# EAGLE design ucar (EAGLE 7.7.0)
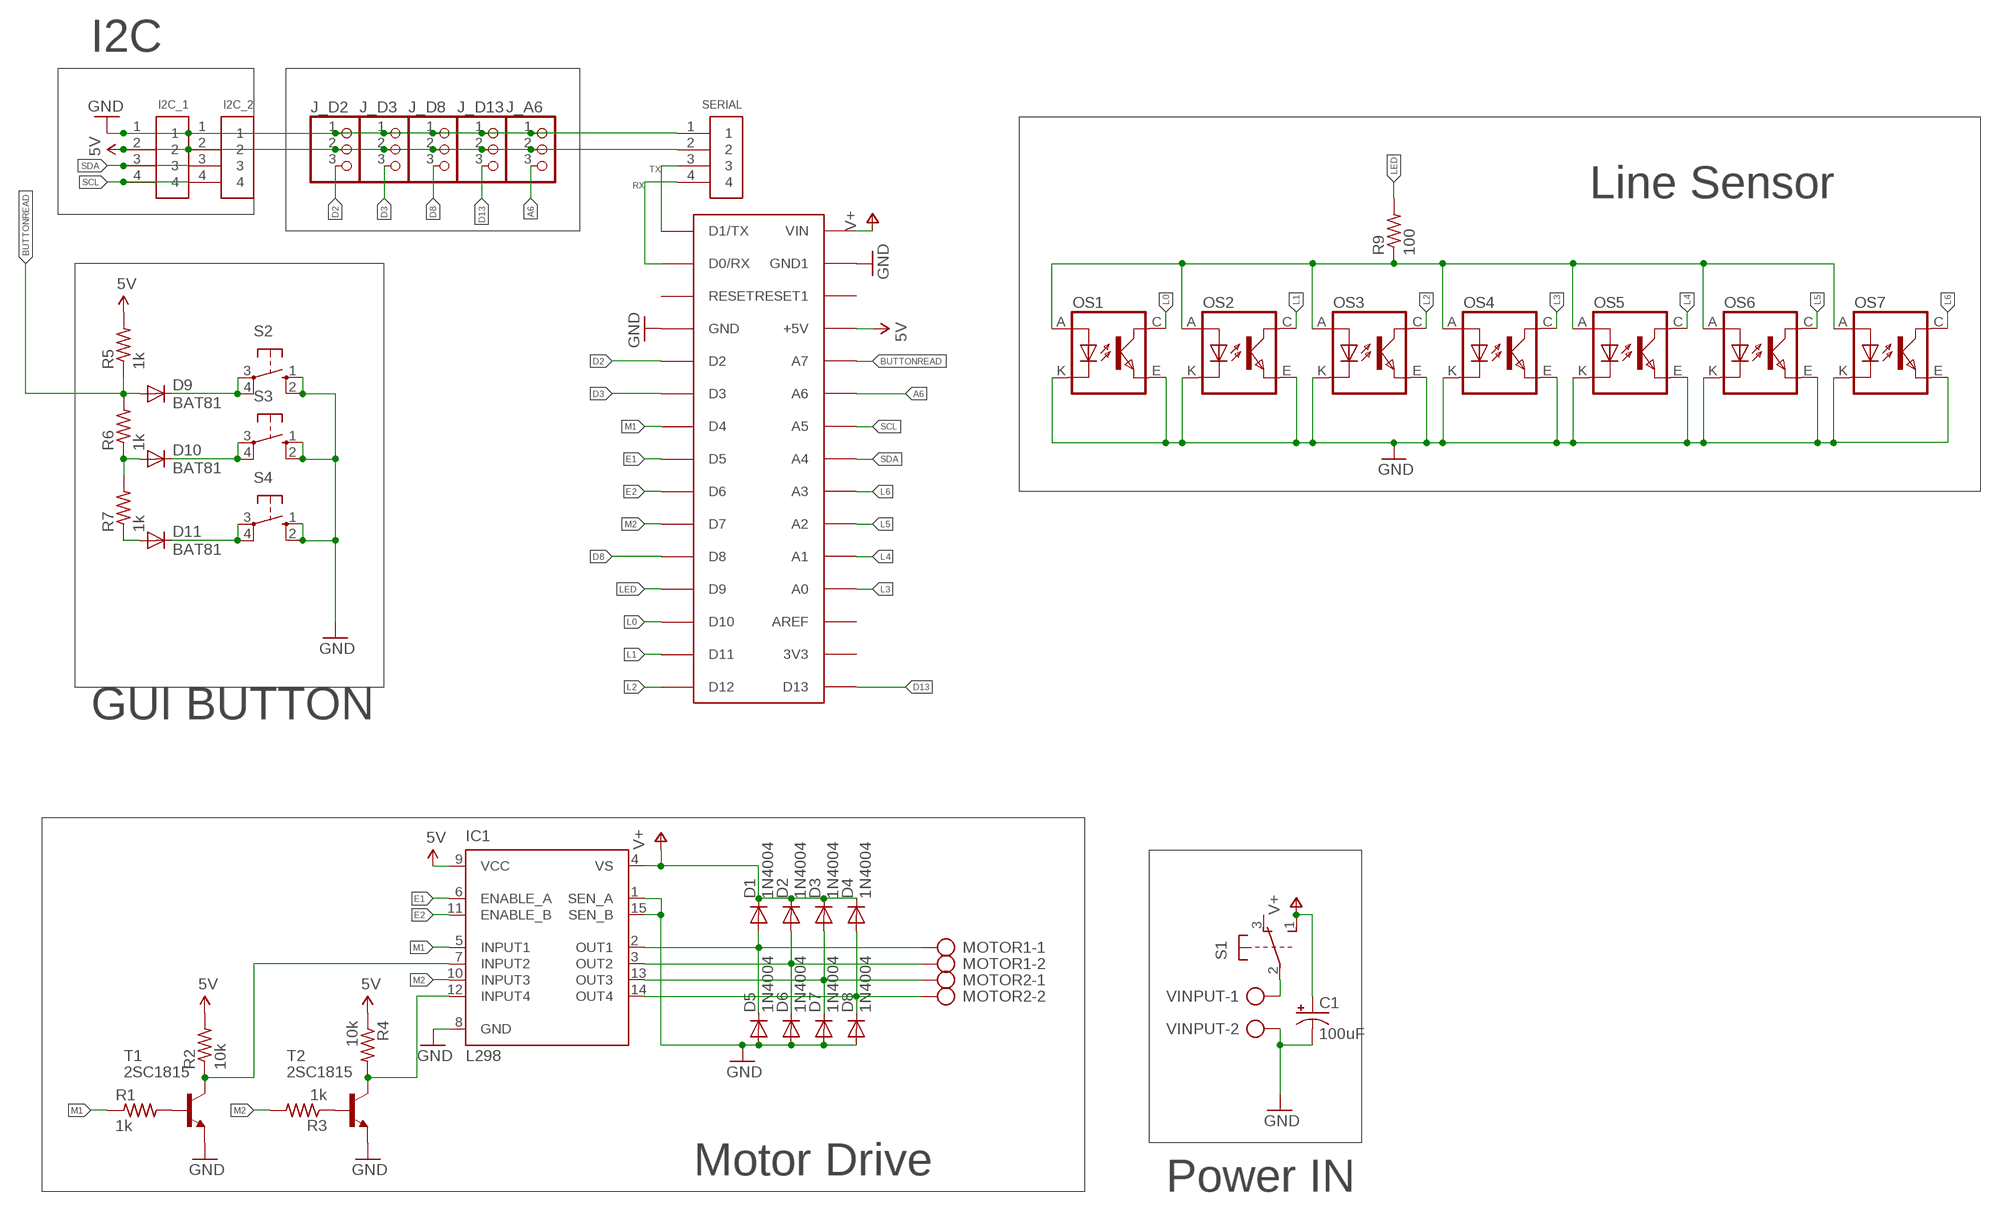
[diagram p0: schematic, sheet 1]

## Parts
C1  100uF  CPOL-USE2.5-6  [E2,5-6]
D1  1N4004  [DO41-10]
D2  1N4004  [DO41-10]
D3  1N4004  [DO41-10]
D4  1N4004  [DO41-10]
D5  1N4004  [DO41-10]
D6  1N4004  [DO41-10]
D7  1N4004  [DO41-10]
D8  1N4004  [DO41-10]
D9  BAT81  [DO34-7]
D10  BAT81  [DO34-7]
D11  BAT81  [DO34-7]
I2C_1  1X4-BIG  [1X04-BIG]
I2C_2  1X4-BIG  [1X04-BIG]
IC1  L298  [MULTIWATT-15]
J_A6  PINHD-1X3  [1X03]
J_D2  PINHD-1X3  [1X03]
J_D3  PINHD-1X3  [1X03]
J_D8  PINHD-1X3  [1X03]
J_D13  PINHD-1X3  [1X03]
MOTOR1  AK500/2  [AK500/2]
MOTOR2  AK500/2  [AK500/2]
OS1  TCRT5000  [TCRT5000]
OS2  TCRT5000  [TCRT5000]
OS3  TCRT5000  [TCRT5000]
OS4  TCRT5000  [TCRT5000]
OS5  TCRT5000  [TCRT5000]
OS6  TCRT5000  [TCRT5000]
OS7  TCRT5000  [TCRT5000]
R1  1k  R-US_0207/7  [0207/7]
R2  10k  R-US_0207/7  [0207/7]
R3  1k  R-US_0207/7  [0207/7]
R4  10k  R-US_0207/7  [0207/7]
R5  1k  R-US_0207/7  [0207/7]
R6  1k  R-US_0207/7  [0207/7]
R7  1k  R-US_0207/7  [0207/7]
R9  100  R-US_0204/5  [0204/5]
S1  9077-2  [9077-2]
S2  10-XX  [B3F-10XX]
S3  10-XX  [B3F-10XX]
S4  10-XX  [B3F-10XX]
SERIAL  1X4-BIG  [1X04-BIG]
T1  2SC1815  [TO92-ECB]
T2  2SC1815  [TO92-ECB]
U$1  ARDUINONANO  [PDIP-32]
VINPUT  AK500/2  [AK500/2]

## Nets
5V: I2C_1.2 I2C_2.2 IC1.9(VCC) J_A6.2 J_D2.2 J_D3.2 J_D8.2 J_D13.2 R2.2 R4.1 R5.2 SERIAL.2 U$1.+5V
A6: J_A6.3 U$1.A6
BUTTONREAD: D9.A R5.1 R6.2 U$1.A7
D2: J_D2.3 U$1.D2
D3: J_D3.3 U$1.D3
D8: J_D8.3 U$1.D8
D13: J_D13.3 U$1.D13
E1: IC1.6(ENABLE_A) U$1.D5
E2: IC1.11(ENABLE_B) U$1.D6
GND: C1.- D5.A D6.A D7.A D8.A I2C_1.1 I2C_2.1 IC1.1(SEN_A) IC1.8(GND) IC1.15(SEN_B) J_A6.1 J_D2.1 J_D3.1 J_D8.1 J_D13.1 OS1.E(EMITTER) OS1.K(CATHODE) OS2.E(EMITTER) OS2.K(CATHODE) OS3.E(EMITTER) OS3.K(CATHODE) OS4.E(EMITTER) OS4.K(CATHODE) OS5.E(EMITTER) OS5.K(CATHODE) OS6.E(EMITTER) OS6.K(CATHODE) OS7.E(EMITTER) OS7.K(CATHODE) S2.1(S) S2.2(S1) S3.1(S) S3.2(S1) S4.1(S) S4.2(S1) SERIAL.1 T1.E T2.E U$1.GND U$1.GND1 VINPUT.2
L0: OS1.C(COLLECTOR) U$1.D10
L1: OS2.C(COLLECTOR) U$1.D11
L2: OS3.C(COLLECTOR) U$1.D12
L3: OS4.C(COLLECTOR) U$1.A0
L4: OS5.C(COLLECTOR) U$1.A1
L5: OS6.C(COLLECTOR) U$1.A2
L6: OS7.C(COLLECTOR) U$1.A3
LED: R9.2 U$1.D9
M1: IC1.5(INPUT1) R1.1 U$1.D4
M2: IC1.10(INPUT3) R3.2 U$1.D7
N$1: OS1.A(ANODE) OS2.A(ANODE) OS3.A(ANODE) OS4.A(ANODE) OS5.A(ANODE) OS6.A(ANODE) OS7.A(ANODE) R9.1
N$2: R1.2 T1.B
N$3: D1.A D5.C IC1.2(OUT1) MOTOR1.1
N$4: R3.1 T2.B
N$5: D2.A D6.C IC1.3(OUT2) MOTOR1.2
N$6: D3.A D7.C IC1.13(OUT3) MOTOR2.1
N$7: IC1.7(INPUT2) R2.1 T1.C
N$8: D4.A D8.C IC1.14(OUT4) MOTOR2.2
N$9: IC1.12(INPUT4) R4.2 T2.C
N$10: S1.2(1:P) VINPUT.1
N$12: D10.A R6.1 R7.2
N$13: D11.A R7.1
N$14: D9.C S2.3(P) S2.4(P1)
N$15: D10.C S3.3(P) S3.4(P1)
N$16: D11.C S4.3(P) S4.4(P1)
RX: SERIAL.4 U$1.D0/RX
SCL: I2C_1.4 I2C_2.4 U$1.A5
SDA: I2C_1.3 I2C_2.3 U$1.A4
TX: SERIAL.3 U$1.D1/TX
V+: C1.+ D1.C D2.C D3.C D4.C IC1.4(VS) S1.1(1:S) U$1.VIN
Unconnected: S1.3(1:O) S1.4(2:S) S1.5(2:P) S1.6(2:O) U$1.3V3 U$1.AREF U$1.RESET U$1.RESET1

## Notes on the sheet
- I2C
- Line Sensor
- GUI BUTTON
- Motor Drive
- Power IN

## Library data of the parts
C1 = rcl:CPOL-US: POLARIZED CAPACITOR, American symbol
D1-D8 = diode:1N4004: DIODE general purpose rectifier, 1 A
D9-D11 = diode:BAT81: DIODE barrier diode
I2C_1 I2C_2 SERIAL = adafruit:1X4: 4-pin connector
IC1 = st-microelectronics:L298: DUAL FULL-BRIDGE DRIVER; MPN: L298N; OC_FARNELL: 1589425; OC_NEWARK: 32M1527
J_A6 J_D2 J_D3 J_D8 J_D13 = adafruit:PINHD-1X3: PIN HEADER
MOTOR1 MOTOR2 VINPUT = con-ptr500:AK500/2: CONNECTOR; OC_FARNELL: unknown; OC_NEWARK: unknown
OS1-OS7 = tcrt5000:TCRT5000
R1-R4 R9 = rcl:R-US_: RESISTOR, American symbol
R5-R7 = resistor:R-US_: RESISTOR, American symbol
S1 = switch-misc:9077-2: MARQUARDT SWITCH 9077.0200 Distributor: Buerklin <https://www.buerklin.com/default.asp?event=ShowArtikel%2812G2822%29&l=d&jump=ArtNr_12G2822>
S2-S4 = switch-omron:10-XX: OMRON SWITCH; MPN: B3F-1000; OC_FARNELL: 176432; OC_NEWARK: 36M3542
T1 T2 = transistor:2SC1815: NPN EPITAXIAL TRANSISTOR Source: TOSHIBA .. 2SC1815 1.pdf
U$1 = jet-lib:ARDUINONANO

## Board
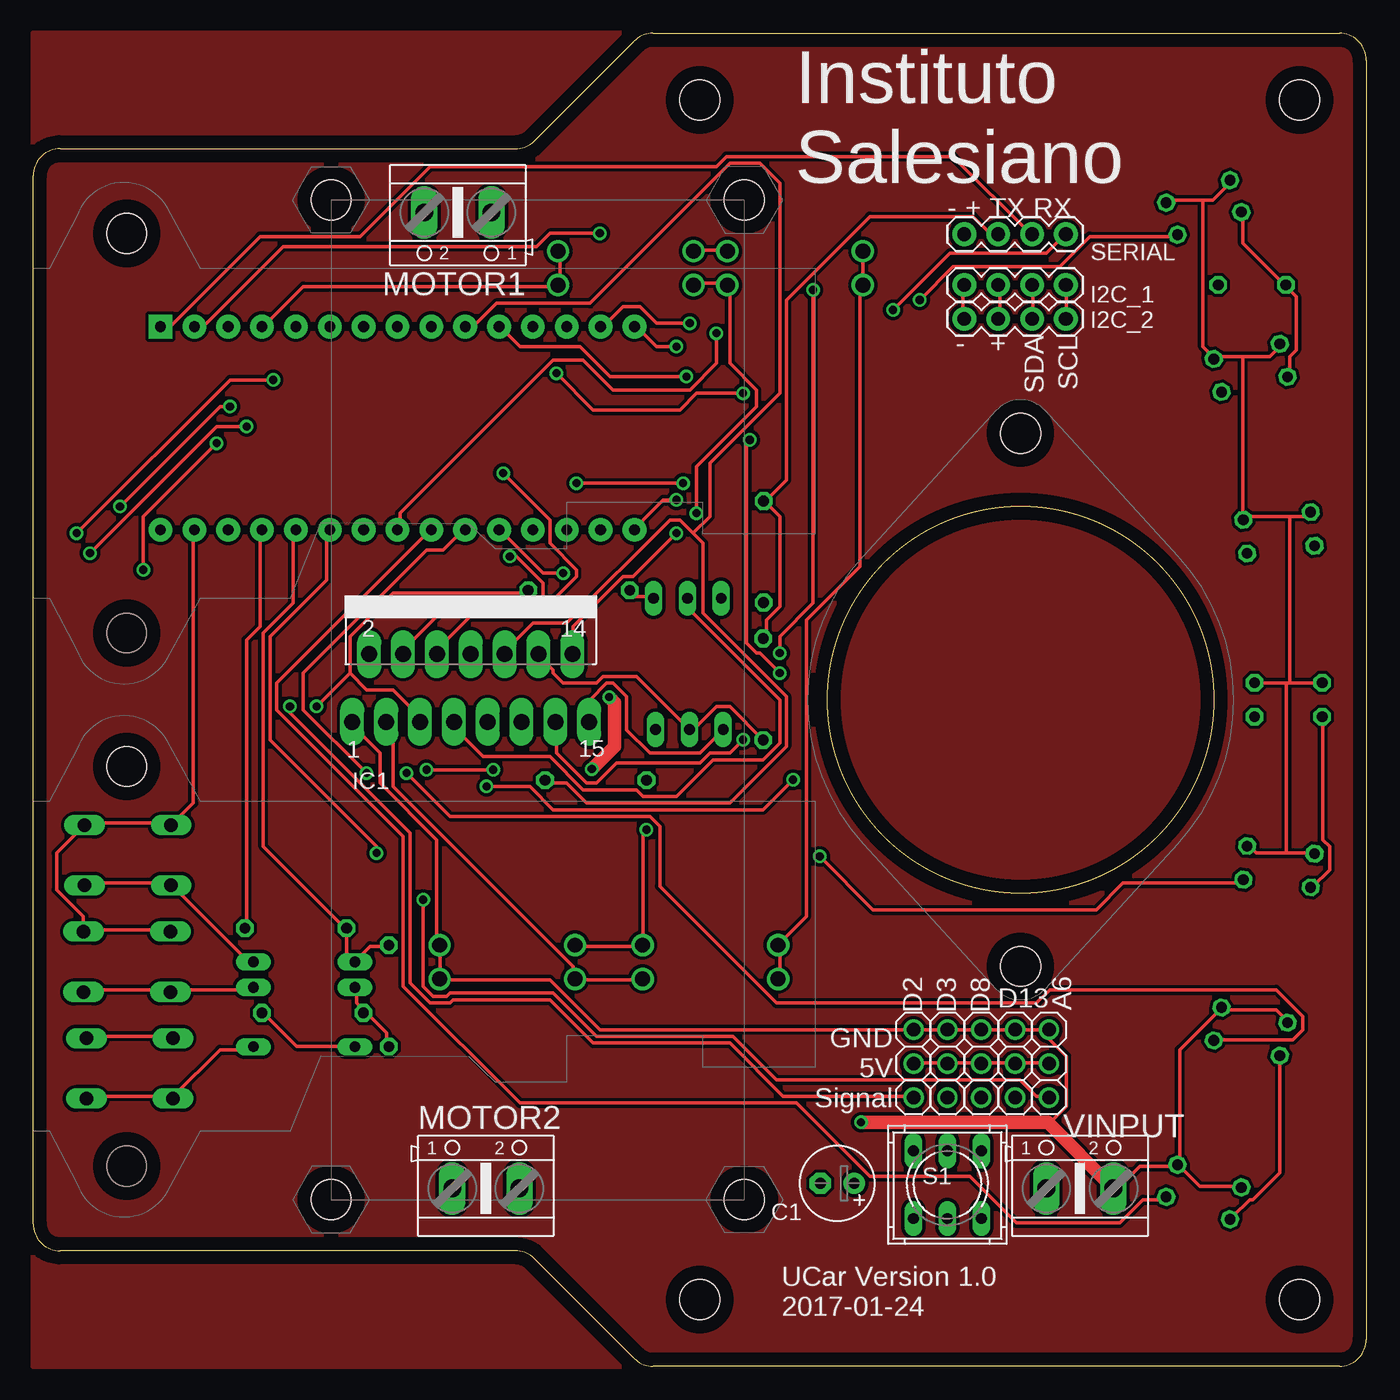
[diagram p1: board, top side]
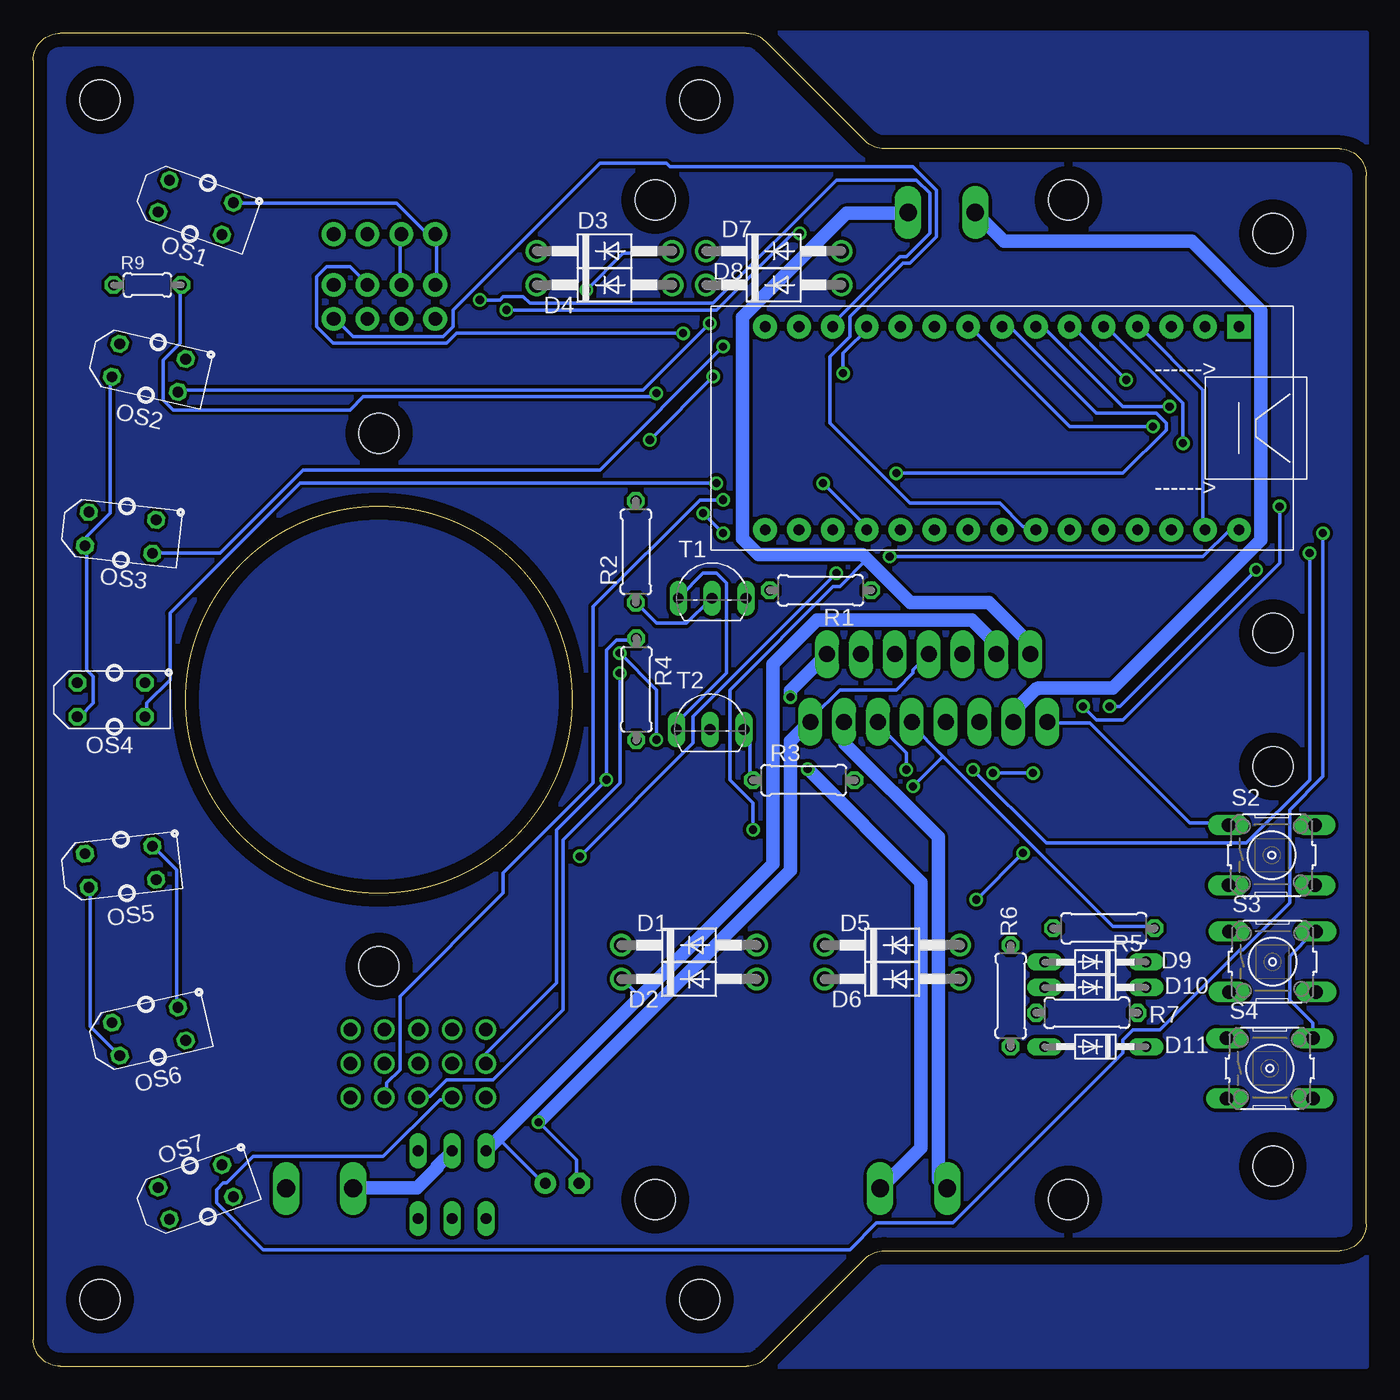
[diagram p2: board, bottom side, seen from below]

Size 100 x 100 mm. Coordinates in mm from the lower left corner, seen from the top.
Outline: 100,98 100,2 arc-90 98,0 46.49,0 arc-45 45.08,0.59 37.59,8.08 arc45 36.17,8.66 2,8.66 arc-90 0,10.66 0,89.34 arc-90 2,91.34 36.17,91.34 arc45 37.59,91.92 45.08,99.41 arc-45 46.49,100 98,100 arc-90 100,98
Outline: circle at 74.07,50 radius 14.5
Copper layers (1*16): Top 0.035mm / dielectric 1.5mm / Bottom 0.035mm
Design rules "default *": minimum track width 0.25mm, minimum drill 24mil, track to track 0.25mm, track to pad 0.25mm, pad to pad 0.25mm, via to via 0.25mm, smd to smd 0.25mm, copper to edge 40mil, drill to drill 8mil, minimum pad ring 10mil, minimum via ring 8mil, stop-mask expansion 4mil, vias tented up to drill 0mil, thermal gap 10mil
Holes 3 mm at 7,84.99 7,55.01 7,44.99 7,15.01 22.34,12.5 53.34,12.5 50,5 95,5 74.07,30 74.07,70 95,95 50,95 53.34,87.5 22.34,87.5

### Footprints (pad centres in the part's own frame; a part is rotated, then mirrored left to right if it is on the bottom)
E2,5-6 = drill 0.813 pad 1.6: + -1.27,0 | drill 0.813 pad 1.6 octagon: - 1.27,0
DO41-10 = drill 1.118: A 5.08,0; C -5.08,0
DO34-7 = drill 0.813 long: A 3.81,0; C -3.81,0
1X04-BIG = drill 1.016 pad 1.778: 1 0,0; 2 2.54,0; 3 5.08,0; 4 7.62,0
MULTIWATT-15 = drill 1.2 long: 1 -8.89,-7.62; 2 -7.62,-2.54; 3 -6.35,-7.62; 4 -5.08,-2.54; 5 -3.81,-7.62; 6 -2.54,-2.54; 7 -1.27,-7.62; 8 0,-2.54; 9 1.27,-7.62; 10 2.54,-2.54; 11 3.81,-7.62; 12 5.08,-2.54; 13 6.35,-7.62; 14 7.62,-2.54; 15 8.89,-7.62
1X03 = drill 1.016: 1 -2.54,0; 2 0,0; 3 2.54,0
AK500/2 = drill 1.321 long: 1 -2.515,0; 2 2.515,0
TCRT5000 = drill 0.8 octagon: A -2.54,-1.27; C 2.54,-1.27; E 2.54,1.27; K -2.54,1.27
0207/7 = drill 0.813 octagon: 1 -3.81,0; 2 3.81,0
0204/5 = drill 0.813 octagon: 1 -2.54,0; 2 2.54,0
9077-2 = drill 0.813 long: 1 -2.54,2.54; 2 0,2.54; 3 2.54,2.54; 4 -2.54,-2.54; 5 0,-2.54; 6 2.54,-2.54
B3F-10XX = drill 1.016 long: 1 -3.251,2.261; 2 3.251,2.261; 3 -3.251,-2.261; 4 3.251,-2.261
TO92-ECB = drill 0.813 long: B 2.54,0; C 0,0; E -2.54,0
PDIP-32 = drill 0.8 pad 1.778: 3V3 15.24,-35.56; +5V 15.24,-10.16; A0 15.24,-30.48; A1 15.24,-27.94; A2 15.24,-25.4; A3 15.24,-22.86; A4 15.24,-20.32; A5 15.24,-17.78; A6 15.24,-15.24; A7 15.24,-12.7; AREF 15.24,-33.02; D0/RX 0,-5.08; D2 0,-12.7; D3 0,-15.24; D4 0,-17.78; D5 0,-20.32; D6 0,-22.86; D7 0,-25.4; D8 0,-27.94; D9 0,-30.48; D10 0,-33.02; D11 0,-35.56; D12 0,-38.1; D13 15.24,-38.1; GND 0,-10.16; GND1 15.24,-5.08; RESET 0,-7.62; RESET1 15.24,-7.62; VIN 15.24,-2.54 | drill 0.8 pad 1.778 square: D1/TX 0,-2.54

### Placement (x,y rotation side)
C1  60.32,13.72 180 top
D1  50.8,31.59 0 bottom
D2  50.8,29.05 0 bottom
D3  57.15,83.66 0 bottom
D4  57.15,81.12 0 bottom
D5  35.56,31.59 0 bottom
D6  35.56,29.05 0 bottom
D7  44.45,83.66 0 bottom
D8  44.45,81.12 0 bottom
D9  20.32,30.32 180 bottom
D10  20.32,28.41 180 bottom
D11  20.32,23.97 180 bottom
I2C_1  69.85,81.12 0 top
I2C_2  69.85,78.58 0 top
IC1  32.82,55.97 0 top
J_A6  76.2,22.7 270 top
J_D2  66.04,22.7 270 top
J_D3  68.58,22.7 270 top
J_D8  71.12,22.7 270 top
J_D13  73.66,22.7 270 top
MOTOR1  31.85,86.56 180 top
MOTOR2  33.95,13.34 0 top
OS1  87.81,86.94 340.5 bottom
OS2  91.33,74.9 347 bottom
OS3  93.45,62.53 353.5 bottom
OS4  94.16,50 0 bottom
OS5  93.45,37.47 6.5 bottom
OS6  91.33,25.11 13 bottom
OS7  87.81,13.06 19.5 bottom
R1  40.94,58.21 180 bottom
R2  54.79,61.1 90 bottom
R3  42.2,43.97 0 bottom
R4  54.76,50.78 270 bottom
R5  19.68,32.86 0 bottom
R6  26.67,27.78 90 bottom
R7  20.95,26.51 180 bottom
R9  91.44,81.12 0 bottom
S1  68.58,13.62 0 top
S2  7.09,38.34 0 bottom
S3  7.03,30.34 0 bottom
S4  7.23,22.34 0 bottom
SERIAL  69.85,84.93 0 top
T1  49.07,57.61 0 bottom
T2  49.22,47.77 0 bottom
U$1  7,78 270 bottom
VINPUT  78.52,13.34 0 top

### Tracks (layer width: path | path; a pad name or v marks a point on that pad's centre or on a via)
5V  (via drill 0.61)
  Top 0.25: U$1.+5V 17,62.75 17,55.5 16,54.5 16,33 R5.2 | J_D2.2 66.25,22.75 68.5,22.75 J_D3.2 68.75,22.75 71,22.75 J_D8.2 71.25,22.75 73.5,22.75 J_D13.2 73.75,22.75 76,22.75 J_A6.2 | I2C_2.2 72.5,78.75 72.5,81 I2C_1.2 | R4.1 55,54.75 55,56 56,57 56,63.75 55,64.75 R2.2 55,65 56.5,66.5 56.5,80 62.75,86.25 70.5,86.25 71.75,85 72.25,85 SERIAL.2 | v34,43.5 37.25,43.5 39,41.75 54.75,41.75 v57,44
  Bottom 0.25: 31.75,45.75 34.25,48.25 IC1.9 | 31.75,45.75 19,33 16,33 R5.2 | SERIAL.2 72.5,84.75 72.5,81.25 I2C_1.2 | J_D2.2 66,22.75 66,23.5 60.75,28.75 60.75,40.25 v57,44 57,53.75 56.25,54.5 55,54.5 R4.1 | v34,43.5 31.75,45.75
A6  (via drill 0.61)
  Top 0.25: v29.25,35 29.25,28.5 30,27.75 31,27.75 31.25,28 39,28 42.25,24.75 52.5,24.75 55.75,21.5 74,21.5 75.25,20.25 76,20.25 J_A6.3 | v25.75,38.5 25.75,39 17.75,47 17.75,54.75 22,59 22,62.75 U$1.A6
  Bottom 0.25: v25.75,38.5 v29.25,35
BUTTONREAD
  Top 0.25: R6.2 26.5,31.5 25.25,31.5 24.25,30.5 D9.A 24,30.5 23.5,31 23.5,32.75 R5.1 23.25,33 17.25,39 17.25,55 19.5,57.25 19.5,62.75 U$1.A7
D2  (via drill 0.61)
  Top 0.25: v19.25,49.5 19.25,49 28.25,40 28.25,28.75 29.75,27.25 31.25,27.25 31.5,27.5 38.75,27.5 42,24.25 52.25,24.25 56.25,20.25 66,20.25 J_D2.3 | v8.25,59.75 8.25,63.75 v13.75,69.25
  Bottom 0.25: v19.25,49.5 18.5,49.5 v8.25,59.75 | v13.75,69.25 13.75,72.25 19.5,78 U$1.D2
D3  (via drill 0.61)
  Top 0.25: v3.25,62.5 14.75,74 v18,74
  Bottom 0.25: v3.25,62.5 3.25,44.25 5.75,41.75 5.75,34.75 9.25,31.25 9.5,31.25 15.5,25.25 17.5,25.25 18.25,24.5 18.25,23.5 31,10.75 36.75,10.75 38.75,8.75 82.75,8.75 86.25,12.25 86.25,13.25 85.75,13.75 85.5,13.75 83.5,15.75 73.75,15.75 69.5,20 68.75,20 J_D3.3 | v18,74 22,78 U$1.D3
D8  (via drill 0.61)
  Top 0.25: v56,52 54.5,53.5 54.25,53.5 53.5,54.25 53.5,69.25 v53.75,69.5 | v49,74.25 43.25,74.25 41,76.5 36.5,76.5 35,78 U$1.D8
  Bottom 0.25: v56,52 56,43.75 60.25,39.5 60.25,26.75 65.5,21.5 69,21.5 70.25,20.25 71,20.25 J_D8.3 | v49,74.25 v53.75,69.5
D13  (via drill 0.61)
  Top 0.25: v48.25,65 47.25,65 45.25,63 U$1.D13
  Bottom 0.25: v48.25,65 50,65 58,57 58,43.75 64.75,37 64.75,35.5 72.5,27.75 72.5,22.25 73.5,21.25 73.5,20.25 J_D13.3
E1  (via drill 0.61)
  Top 0.25: v35.25,67 38.75,63.5 38.75,61.75 40.75,59.75 40.75,59.25 37.75,56.25 32.75,56.25 30.5,54 30.5,53.5 IC1.6
  Bottom 0.25: U$1.D5 26.75,78 20.25,71.5 15.75,71.5 15,70.75 15,70.25 18.25,67 v35.25,67
E2  (via drill 0.61)
  Top 0.25: v16,70.5 13.75,70.5 v4.25,61 | v34.5,44.75 v29.5,44.75
  Bottom 0.25: v16,70.5 22.25,70.5 29.75,78 U$1.D6 | v4.25,61 4.25,44 9,39.25 24,39.25 v29.5,44.75 | v34.5,44.75 34.5,46 36.75,48.25 IC1.11
GND  (via drill 0.61)
  Top 0.25: D7.A 39.5,83.5 39.5,81.25 D8.A 39.25,81 20.25,81 17.25,78 U$1.GND | S4.2 4,24.75 10.25,24.75 S4.1 | S3.1 10.25,32.75 4,32.75 S3.2 3.75,32.75 3.75,33.75 1.75,35.75 1.75,38.5 3.75,40.5 S2.2 4,40.75 10.25,40.75 S2.1 10.5,40.75 12,42.25 12,62.75 U$1.GND1 | IC1.1 23.75,48.25 26,46 26,43.75 30.25,39.5 30.25,31.75 D5.A 30.5,31.5 30.5,29.25 D6.A 30.5,29 38.75,29 42.5,25.25 66,25.25 J_D2.1 66.25,25.25 68.5,25.25 J_D3.1 68.75,25.25 71,25.25 J_D8.1 71.25,25.25 73.5,25.25 J_D13.1 73.75,25.25 76,25.25 J_A6.1 76.25,25 76.25,24.5 77.5,23.25 77.5,19.5 76.5,18.5 76.1,18.3 | I2C_2.1 69.75,78.75 69.75,81 I2C_1.1 | 87.75,87.5 88.5,87.5 89.75,88.75 OS1.K | 87.75,87.5 85,87.5 OS1.E | OS6.K 94,26 93.25,26.75 89.25,26.75 OS6.E 89,26.75 86,23.75 86,15.25 OS7.E | 90.75,75.75 92.75,75.75 93.5,76.5 OS2.K | 90.75,75.75 88.75,75.75 OS2.E 88.5,75.75 87.75,76.5 87.75,87.5 | 94,38.5 91.75,38.5 91.25,39 OS5.E | 94,38.5 96,38.5 OS5.K | 94.25,51.25 96.5,51.25 OS4.K | 94.25,51.25 94,51.25 | 94,51.25 91.75,51.25 OS4.E | 94.25,63.75 95.5,63.75 95.75,64 OS3.K | 94.25,63.75 91,63.75 OS3.E 90.75,63.75 90.75,75.75 | 94.25,63.75 94.25,51.25 | 94,51.25 94,38.5 | OS7.E 85.75,15 83,15 81.5,13.5 VINPUT.2 | OS7.K 90.5,13.5 87.5,13.5 86,15 OS7.E | T2.E 51.75,47.75 50,46 46.25,46 44.5,47.75 44.5,50.25 43.5,51.25 43,51.25 41.75,50 41.75,48.5 IC1.15
  Top 1: v62.1,18.3 76.1,18.3 81,13.4 VINPUT.2
  Bottom 0.25: U$1.GND1 12.25,63 12.25,73.25 17,78 U$1.GND | S4.2 4,24.75 4,25.75 5.75,27.5 5.75,30.75 4,32.5 S3.2 | IC1.1 23.75,48.25 20.75,48.25 13.25,40.75 10.5,40.75 S2.1 | I2C_1.1 69.75,81.25 69.75,84.75 SERIAL.1 70,85 70.5,85 72.75,87.25 84.75,87.25 OS1.E | OS6.E 89.25,27 89.25,37.25 91,39 OS5.E | T1.E 51.5,57.75 49.75,59.5 48.75,59.5 48,58.75 48,52 52,48 T2.E | C1.- 59.25,13.75 59.25,15.5 61.75,18 v62.1,18.3 | IC1.8 34,52.25 34,52 35.25,50.75 39.5,50.75 41.5,48.75 IC1.15
  Bottom 1: v62.1,18.3 43.2,37.2 43.2,46.9 41.8,48.3 IC1.15
L0  (via drill 0.61)
  Top 0.25: v66.5,80 69,82.5 77,82.5 79.25,84.75 85.75,84.75 OS1.C
  Bottom 0.25: v66.5,80 65,80 64.75,80.25 63.25,80.25 62.75,79.75 49,79.75 39.75,89 33.75,89 32.75,88 32.75,85 34.5,83.25 35,83.25 40.25,78 U$1.D10
L1  (via drill 0.61)
  Top 0.25: v49.25,78.25 46.75,78.25 45.5,79.5 44.25,79.5 42.75,78 U$1.D11
  Bottom 0.25: v49.25,78.25 54.25,73.25 89,73.25 OS2.C
L2  (via drill 0.61)
  Top 0.25: v48.25,76.5 46.75,76.5 45.25,78 U$1.D12
  Bottom 0.25: v48.25,76.5 57.5,67.25 79.75,67.25 86,61 91,61 OS3.C
L3  (via drill 0.61)
  Top 0.25: v40.75,66.25 v48.75,66.25
  Bottom 0.25: v48.75,66.25 80,66.25 89.75,56.5 89.75,51.5 91.5,49.75 91.5,48.75 OS4.C | v40.75,66.25 37.5,63 U$1.A0
L4  (via drill 0.61)
  Top 0.25: v59,38.25 63,34.25 79.75,34.25 81.75,36.25 90.75,36.25 OS5.C | v39.75,59.5 38.25,59.5 35,62.75 U$1.A1
  Bottom 0.25: v59,38.25 50.5,46.75 50.5,48.75 v39.75,59.5
L5  (via drill 0.61)
  Top 0.25: v28,44.5 31.25,41.25 46.25,41.25 47,40.5 47,36 55.75,27.25 75.25,27.25 76.25,28.25 93.25,28.25 95.25,26.25 95.25,25.25 94.5,24.5 88.75,24.5 OS6.C | v25,44.5 20.25,49.25 20.25,52 29.5,61.25 30.75,61.25 32.25,62.75 U$1.A2
  Bottom 0.25: v25,44.5 v28,44.5
L6
  Top 0.25: OS7.C 84.75,12.5 83.25,12.5 81.5,10.75 73.75,10.75 70.25,14.25 62.75,14.25 57.25,19.75 36.5,19.75 27.75,28.5 27.75,39.75 18.25,49.25 18.25,51.25 29.75,62.75 U$1.A3
LED  (via drill 0.61)
  Top 0.25: v53.25,73 49.75,73 48.5,71.75 42,71.75 v39.25,74.5
  Bottom 0.25: v53.25,73 53.5,72.75 75.25,72.75 76.25,71.75 89.5,71.75 90.25,72.5 90.25,75.5 89,76.75 89,81 R9.2 | v39.25,74.5 39.25,76 37.25,78 U$1.D9
M1  (via drill 0.61)
  Top 0.25: 23.75,52 23.75,54.75 27,58 37,58 R1.1 | 23.75,52 25,50.75 27,50.75 29.25,48.5 IC1.5 | v14.75,72 14,72 v6.5,64.5 | 23.75,52 v21.25,49.5
  Bottom 0.25: U$1.D4 24.25,78 18.25,72 v14.75,72 | v6.5,64.5 6.5,60.25 18.25,48.5 20.25,48.5 v21.25,49.5
M2
  Top 0.25: 49.5,62.5 48.5,63.5 47.75,63.5 40,55.75 37.5,55.75 35.25,53.5 IC1.10 | 49.5,62.5 50.25,61.75 50.25,56.5 56.5,50.25 56.5,46.5 52.25,42.25 41.5,42.25 40,43.75 38.5,43.75 R3.2 | U$1.D7 33,78 34.75,79.75 41.75,79.75 52.25,90.25 54.5,90.25 56,88.75 56,73 50.75,67.75 50.75,63.75 49.5,62.5
N$1
  Top 0.25: OS2.A 94.25,74.25 94.25,75.75 94.75,76.25 94.75,80.25 94,81 R9.1 93.75,81.25 90.75,84.25 90.75,86.5 OS1.A | OS7.A 90,11.25 91.25,12.5 91.5,12.5 93.5,14.5 93.5,23.25 OS6.A | OS4.A 96.75,48.5 96.75,39.5 97.25,39 97.25,37.25 96,36 OS5.A
  Bottom 0.25: OS2.A 94.25,74 94.25,64 96,62.25 96,61.75 OS3.A 96,61.5 96,52.25 95.5,51.75 95.5,49.75 96.5,48.75 OS4.A | OS5.A 95.75,35.75 95.75,25.5 93.75,23.5 OS6.A
N$2
  Top 0.25: T1.B 46.5,57.75 45,57.75 44.75,58 R1.2
N$3  (via drill 0.61)
  Top 0.25: D5.C 40.75,31.5 45.5,31.5 D1.A 45.75,31.75 45.75,40 v46,40.25
  Bottom 0.25: v46,40.25 46,42.25 47.75,44 47.75,50.75 40,58.5 39.5,58.5 37.45,60.55
  Bottom 1: IC1.2 25.2,54.2 28.3,57.3 34.2,57.3 37.45,60.55 37.8,60.9 45.6,60.9 46.8,62.1 46.8,78.7 39,86.5 34.4,86.5 MOTOR1.1
N$4
  Bottom 0.25: R3.1 46.25,44 46.25,47.5 46.5,47.75 T2.B
N$5
  Top 0.25: D2.A 45.5,29 40.75,29 D6.C 40.5,29.25 40.5,30 27,43.5 27,47.75 26.5,48.25 IC1.3
  Bottom 1: IC1.3 26.4,48.4 26.4,49.2 24.8,50.8 24.7,50.8 24.6,50.9 19,50.9 7.9,62 7.9,79.2 13.1,84.4 27.2,84.4 29.3,86.5 MOTOR1.2
N$6  (via drill 0.61)
  Top 0.25: D7.C 49.75,83.75 52,83.75 D3.A | v58.5,80.75 58.5,57.25 56,54.75 v56,53.5 | v53.25,47 52.25,46 50.75,46 50,45.25 43.75,45.25 42.25,43.75 41.5,43.75 39.25,46 39.25,48.25 IC1.13
  Bottom 0.25: v58.5,80.75 55.75,83.5 52.25,83.5 D3.A | v56,53.5 53.25,50.75 v53.25,47
  Bottom 1: IC1.13 39.1,48.3 39.1,46.7 32.1,39.7 32.1,14 31.5,13.4 MOTOR2.1
N$7
  Top 0.25: IC1.7 31.75,48.25 31.75,47.75 33.75,45.75 38.75,45.75 41.25,43.25 45.25,43.25 45.75,42.75 48.25,42.75 51,45.5 54.75,45.5 56,46.75 56,50 49.25,56.75 49.25,57.5 T1.C
  Bottom 0.25: R2.1 53.25,55.75 51,55.75 49.25,57.5 T1.C
N$8  (via drill 0.61)
  Top 0.25: D8.C 49.75,81.25 52,81.25 D4.A 52.25,81 52.25,75.25 54.25,73.25 54.25,72 49.75,67.5 v49.75,64 | v48.25,62.5 45,59.25 44.25,59.25 40.5,55.5 40.5,53.5 IC1.14
  Top 1: v43.2,50.2 43.6,49.8 43.6,46.5 v41.9,44.8
  Bottom 0.25: v48.25,62.5 v49.75,64
  Bottom 1: v43.2,50.2 43.2,50.7 40.5,53.4 IC1.14 | v41.9,44.8 33.4,36.3 33.4,16.4 36.4,13.4 MOTOR2.2
N$9
  Top 0.25: R4.2 54.75,47 52.25,49.5 51.25,49.5 49.75,48 49.25,48 T2.C 49,48 45.25,51.75 42.75,51.75 42.25,51.25 39.75,51.25 39,52 39,52.25 38,53.25 IC1.12
N$10
  Bottom 1: S1.2 68.6,16.1 69.7,15 69.7,14.9 71.2,13.4 76,13.4 VINPUT.1
N$11
  pour Bottom: 0,0 100,0 100,100 0,100
N$12
  Top 0.25: R6.1 26.5,24 26.5,25 25,26.5 R7.2 24.75,26.75 24.25,27.25 24.25,28.25 D10.A
N$13
  Top 0.25: D11.A 24,24 19.75,24 17.25,26.5 R7.1
N$14
  Top 0.25: D9.C 16.5,30.5 16,30.5 10.5,36 S2.3 10.25,36.25 4,36.25 S2.4
N$15
  Top 0.25: D10.C 16.5,28.25 10.5,28.25 S3.3 10.25,28.25 4,28.25 S3.4
N$16
  Top 0.25: D11.C 16.5,23.75 14,23.75 10.5,20.25 S4.3 10.25,20.25 4,20.25 S4.4
N$17
  pour Top: 0,0 100,0 100,100 0,100
RX  (via drill 0.61)
  Top 0.25: U$1.D0/RX 12.75,78 18.75,84 37.75,84 38.75,85 v42.5,85 | v64.5,79.25 68.75,83.5 76,83.5 77.25,84.75 SERIAL.4
  Bottom 0.25: v42.5,85 43,85 48.75,79.25 v64.5,79.25
SCL
  Top 0.25: I2C_1.4 77.5,81 77.5,78.75 I2C_2.4
  Bottom 0.25: U$1.A5 25,63 25.75,63 27.5,64.75 34.25,64.75 40.25,70.75 40.25,75.75 38.75,77.25 38.75,78.75 34.75,82.75 34.25,82.75 32.25,84.75 32.25,88.25 34,90 52.25,90 52.5,90.25 57.5,90.25 68.5,79.25 68.5,78 69.25,77.25 76,77.25 77.25,78.5 I2C_2.4
SDA  (via drill 0.61)
  Top 0.25: v51.25,77.5 51.25,75.25 49.25,73.25 43.5,73.25 41.25,75.5 39,75.5 27.5,64 27.5,63 U$1.A4 | I2C_2.3 75,78.75 75,81 I2C_1.3
  Bottom 0.25: v51.25,77.5 68.25,77.5 69,76.75 77.5,76.75 78.75,78 78.75,81.75 78,82.5 76.25,82.5 75,81.25 I2C_1.3
TX
  Top 0.25: U$1.D1/TX 10.25,78 17,84.75 24.5,84.75 29.75,90 51.25,90 52,90.75 69,90.75 74.75,85 SERIAL.3
V+  (via drill 0.61)
  Top 0.25: D3.C 62.25,83.5 62.25,81.25 D4.C 62,81 62,60 58,56 58,33.75 56,31.75 D1.C 56,31.5 56,29.25 D2.C | v35.75,60.75 36.25,60.75 38.25,58.75 38.25,57.75 37.25,56.75 30.75,56.75 27.5,53.5 IC1.4
  Bottom 0.25: 65.1,17.1 61.75,13.75 C1.+ | 54.48,27.73 55.75,29 D2.C | v35.75,60.75 12.25,60.75 10.25,62.75 9.75,62.75 U$1.VIN
  Bottom 1: S1.1 65.1,17.1 54.48,27.73 44.5,37.7 44.5,52.7 41.2,56 29.6,56 27.8,54.2 27.8,53.5 IC1.4

### Text on the board
tPlace: Instituto / Salesiano | - + TX RX | SDA | SCL | - | + | D13 | D2 | D3 | D8 | A6 | GND / 5V / Signal | UCar Version 1.0 / 2017-01-24
tDocu: + | - | + | - | + | -